# EAGLE design Line (EAGLE 9.6.2)
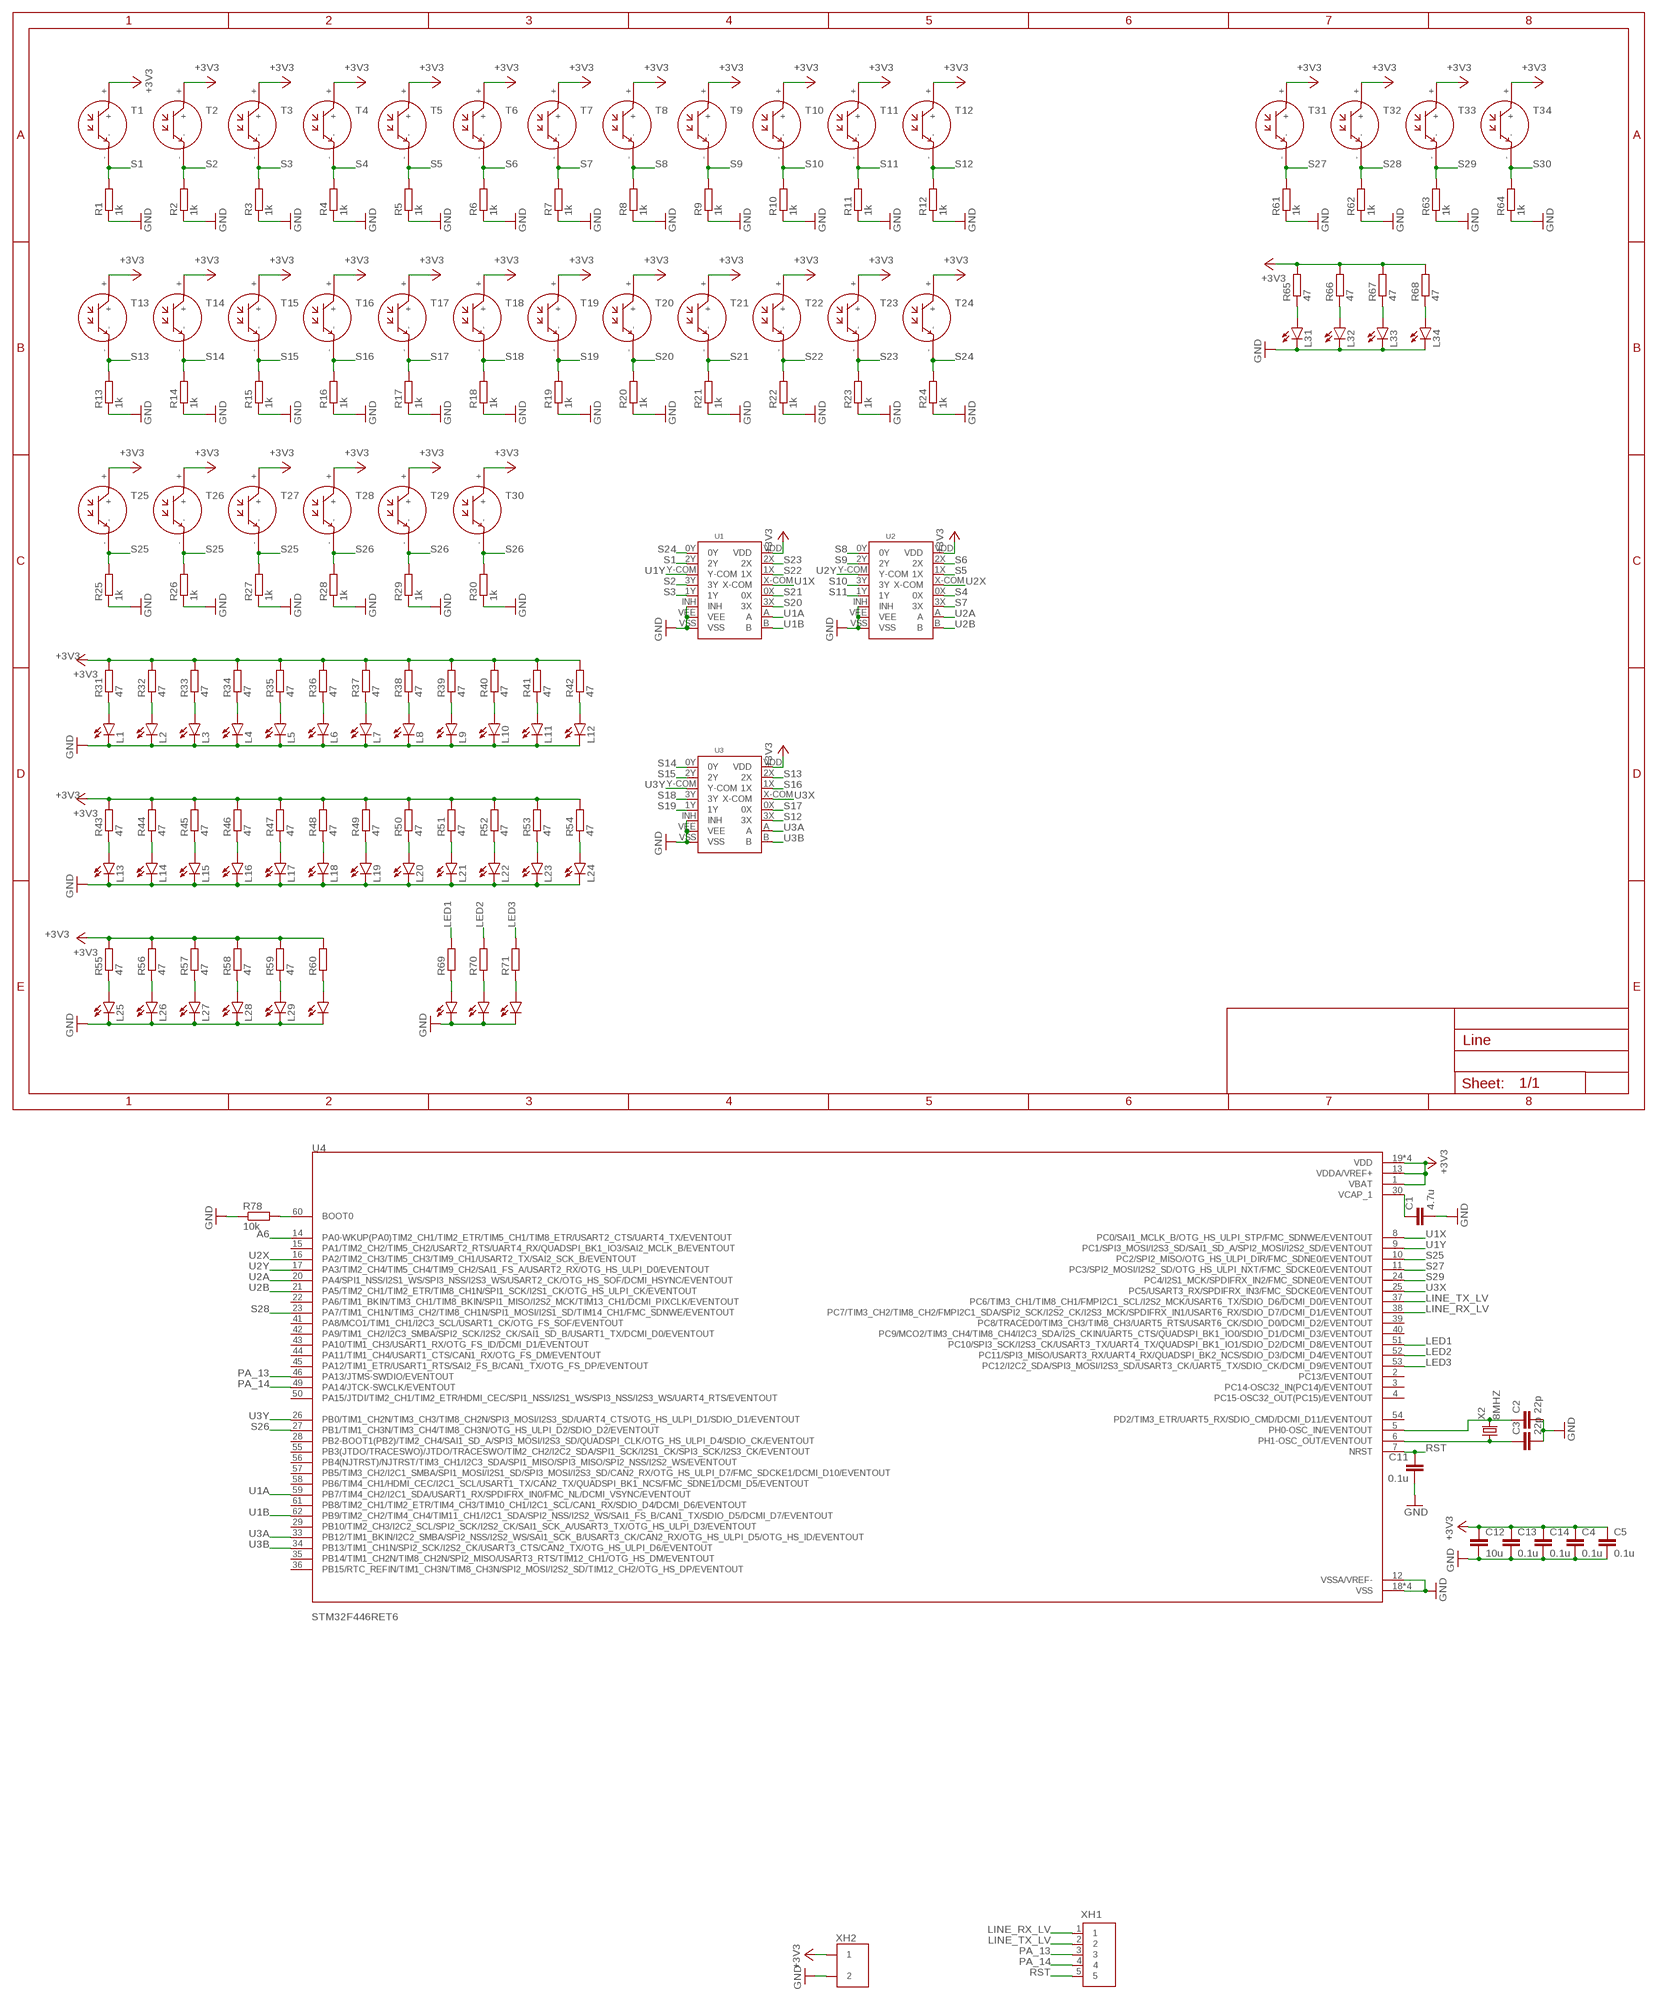
[diagram p0: schematic, sheet 1]

## Parts
C1  4.7u  C-EUC0603  [C0603]
C2  22p  C-EUC0603  [C0603]
C3  22p  C-EUC0603  [C0603]
C4  0.1u  C-EUC0603  [C0603]
C5  0.1u  C-EUC0603  [C0603]
C11  0.1u  C-EUC0603  [C0603]
C12  10u  C-EUC0805  [C0805]
C13  0.1u  C-EUC0603  [C0603]
C14  0.1u  C-EUC0603  [C0603]
L1  SML-E12P8WT86  [LED_SML-LXFM0603SIC-TR]
L2  SML-E12P8WT86  [LED_SML-LXFM0603SIC-TR]
L3  SML-E12P8WT86  [LED_SML-LXFM0603SIC-TR]
L4  SML-E12P8WT86  [LED_SML-LXFM0603SIC-TR]
L5  SML-E12P8WT86  [LED_SML-LXFM0603SIC-TR]
L6  SML-E12P8WT86  [LED_SML-LXFM0603SIC-TR]
L7  SML-E12P8WT86  [LED_SML-LXFM0603SIC-TR]
L8  SML-E12P8WT86  [LED_SML-LXFM0603SIC-TR]
L9  SML-E12P8WT86  [LED_SML-LXFM0603SIC-TR]
L10  SML-E12P8WT86  [LED_SML-LXFM0603SIC-TR]
L11  SML-E12P8WT86  [LED_SML-LXFM0603SIC-TR]
L12  SML-E12P8WT86  [LED_SML-LXFM0603SIC-TR]
L13  SML-E12P8WT86  [LED_SML-LXFM0603SIC-TR]
L14  SML-E12P8WT86  [LED_SML-LXFM0603SIC-TR]
L15  SML-E12P8WT86  [LED_SML-LXFM0603SIC-TR]
L16  SML-E12P8WT86  [LED_SML-LXFM0603SIC-TR]
L17  SML-E12P8WT86  [LED_SML-LXFM0603SIC-TR]
L18  SML-E12P8WT86  [LED_SML-LXFM0603SIC-TR]
L19  SML-E12P8WT86  [LED_SML-LXFM0603SIC-TR]
L20  SML-E12P8WT86  [LED_SML-LXFM0603SIC-TR]
L21  SML-E12P8WT86  [LED_SML-LXFM0603SIC-TR]
L22  SML-E12P8WT86  [LED_SML-LXFM0603SIC-TR]
L23  SML-E12P8WT86  [LED_SML-LXFM0603SIC-TR]
L24  SML-E12P8WT86  [LED_SML-LXFM0603SIC-TR]
L25  SML-E12P8WT86  [LED_SML-LXFM0603SIC-TR]
L26  SML-E12P8WT86  [LED_SML-LXFM0603SIC-TR]
L27  SML-E12P8WT86  [LED_SML-LXFM0603SIC-TR]
L28  SML-E12P8WT86  [LED_SML-LXFM0603SIC-TR]
L29  SML-E12P8WT86  [LED_SML-LXFM0603SIC-TR]
L30  SML-E12P8WT86  [LED_SML-LXFM0603SIC-TR]
L31  SML-E12P8WT86  [LED_SML-LXFM0603SIC-TR]
L32  SML-E12P8WT86  [LED_SML-LXFM0603SIC-TR]
L33  SML-E12P8WT86  [LED_SML-LXFM0603SIC-TR]
L34  SML-E12P8WT86  [LED_SML-LXFM0603SIC-TR]
L35  SML-E12P8WT86  [LED_SML-LXFM0603SIC-TR]
L36  SML-E12P8WT86  [LED_SML-LXFM0603SIC-TR]
L37  SML-E12P8WT86  [LED_SML-LXFM0603SIC-TR]
R1  1k  R-EU_R0603  [R0603]
R2  1k  R-EU_R0603  [R0603]
R3  1k  R-EU_R0603  [R0603]
R4  1k  R-EU_R0603  [R0603]
R5  1k  R-EU_R0603  [R0603]
R6  1k  R-EU_R0603  [R0603]
R7  1k  R-EU_R0603  [R0603]
R8  1k  R-EU_R0603  [R0603]
R9  1k  R-EU_R0603  [R0603]
R10  1k  R-EU_R0603  [R0603]
R11  1k  R-EU_R0603  [R0603]
R12  1k  R-EU_R0603  [R0603]
R13  1k  R-EU_R0603  [R0603]
R14  1k  R-EU_R0603  [R0603]
R15  1k  R-EU_R0603  [R0603]
R16  1k  R-EU_R0603  [R0603]
R17  1k  R-EU_R0603  [R0603]
R18  1k  R-EU_R0603  [R0603]
R19  1k  R-EU_R0603  [R0603]
R20  1k  R-EU_R0603  [R0603]
R21  1k  R-EU_R0603  [R0603]
R22  1k  R-EU_R0603  [R0603]
R23  1k  R-EU_R0603  [R0603]
R24  1k  R-EU_R0603  [R0603]
R25  1k  R-EU_R0603  [R0603]
R26  1k  R-EU_R0603  [R0603]
R27  1k  R-EU_R0603  [R0603]
R28  1k  R-EU_R0603  [R0603]
R29  1k  R-EU_R0603  [R0603]
R30  1k  R-EU_R0603  [R0603]
R31  47  R-EU_R0603  [R0603]
R32  47  R-EU_R0603  [R0603]
R33  47  R-EU_R0603  [R0603]
R34  47  R-EU_R0603  [R0603]
R35  47  R-EU_R0603  [R0603]
R36  47  R-EU_R0603  [R0603]
R37  47  R-EU_R0603  [R0603]
R38  47  R-EU_R0603  [R0603]
R39  47  R-EU_R0603  [R0603]
R40  47  R-EU_R0603  [R0603]
R41  47  R-EU_R0603  [R0603]
R42  47  R-EU_R0603  [R0603]
R43  47  R-EU_R0603  [R0603]
R44  47  R-EU_R0603  [R0603]
R45  47  R-EU_R0603  [R0603]
R46  47  R-EU_R0603  [R0603]
R47  47  R-EU_R0603  [R0603]
R48  47  R-EU_R0603  [R0603]
R49  47  R-EU_R0603  [R0603]
R50  47  R-EU_R0603  [R0603]
R51  47  R-EU_R0603  [R0603]
R52  47  R-EU_R0603  [R0603]
R53  47  R-EU_R0603  [R0603]
R54  47  R-EU_R0603  [R0603]
R55  47  R-EU_R0603  [R0603]
R56  47  R-EU_R0603  [R0603]
R57  47  R-EU_R0603  [R0603]
R58  47  R-EU_R0603  [R0603]
R59  47  R-EU_R0603  [R0603]
R60  47  R-EU_R0603  [R0603]
R61  1k  R-EU_R0603  [R0603]
R62  1k  R-EU_R0603  [R0603]
R63  1k  R-EU_R0603  [R0603]
R64  1k  R-EU_R0603  [R0603]
R65  47  R-EU_R0603  [R0603]
R66  47  R-EU_R0603  [R0603]
R67  47  R-EU_R0603  [R0603]
R68  47  R-EU_R0603  [R0603]
R69  150  R-EU_R0603  [R0603]
R70  150  R-EU_R0603  [R0603]
R71  150  R-EU_R0603  [R0603]
R78  10k  R-EU_R0603  [R0603]
T1  NJL7302L-F3  [NJL7302L-F3]
T2  NJL7302L-F3  [NJL7302L-F3]
T3  NJL7302L-F3  [NJL7302L-F3]
T4  NJL7302L-F3  [NJL7302L-F3]
T5  NJL7302L-F3  [NJL7302L-F3]
T6  NJL7302L-F3  [NJL7302L-F3]
T7  NJL7302L-F3  [NJL7302L-F3]
T8  NJL7302L-F3  [NJL7302L-F3]
T9  NJL7302L-F3  [NJL7302L-F3]
T10  NJL7302L-F3  [NJL7302L-F3]
T11  NJL7302L-F3  [NJL7302L-F3]
T12  NJL7302L-F3  [NJL7302L-F3]
T13  NJL7302L-F3  [NJL7302L-F3]
T14  NJL7302L-F3  [NJL7302L-F3]
T15  NJL7302L-F3  [NJL7302L-F3]
T16  NJL7302L-F3  [NJL7302L-F3]
T17  NJL7302L-F3  [NJL7302L-F3]
T18  NJL7302L-F3  [NJL7302L-F3]
T19  NJL7302L-F3  [NJL7302L-F3]
T20  NJL7302L-F3  [NJL7302L-F3]
T21  NJL7302L-F3  [NJL7302L-F3]
T22  NJL7302L-F3  [NJL7302L-F3]
T23  NJL7302L-F3  [NJL7302L-F3]
T24  NJL7302L-F3  [NJL7302L-F3]
T25  NJL7302L-F3  [NJL7302L-F3]
T26  NJL7302L-F3  [NJL7302L-F3]
T27  NJL7302L-F3  [NJL7302L-F3]
T28  NJL7302L-F3  [NJL7302L-F3]
T29  NJL7302L-F3  [NJL7302L-F3]
T30  NJL7302L-F3  [NJL7302L-F3]
T31  NJL7302L-F3  [NJL7302L-F3]
T32  NJL7302L-F3  [NJL7302L-F3]
T33  NJL7302L-F3  [NJL7302L-F3]
T34  NJL7302L-F3  [NJL7302L-F3]
U1  TC4051BP  [TC4051BP]
U2  TC4051BP  [TC4051BP]
U3  TC4051BP  [TC4051BP]
U4  STM32F446RET6  [QFP50P1200X1200X160-64N]
X2  8MHZ  16MHZ  [16MHZ]
XH1  5B  [5B]
XH2  2B  [2B]

## Nets
+3V3: C4.1 C5.1 C12.1 C13.1 C14.1 R31.2 R32.2 R33.2 R34.2 R35.2 R36.2 R37.2 R38.2 R39.2 R40.2 R41.2 R42.2 R43.2 R44.2 R45.2 R46.2 R47.2 R48.2 R49.2 R50.2 R51.2 R52.2 R53.2 R54.2 R55.2 R56.2 R57.2 R58.2 R59.2 R60.2 R65.2 R66.2 R67.2 R68.2 T1.+ T2.+ T3.+ T4.+ T5.+ T6.+ T7.+ T8.+ T9.+ T10.+ T11.+ T12.+ T13.+ T14.+ T15.+ T16.+ T17.+ T18.+ T19.+ T20.+ T21.+ T22.+ T23.+ T24.+ T25.+ T26.+ T27.+ T28.+ T29.+ T30.+ T31.+ T32.+ T33.+ T34.+ U1.VDD U2.VDD U3.VDD U4.1(VBAT) U4.13(VDDA/VREF+) U4.19(VDD) U4.32(VDD) U4.48(VDD) U4.64(VDD) XH2.P$1
A6: U4.14(PA0-WKUP(PA0)TIM2_CH1/TIM2_ETR/TIM5_CH1/TIM8_ETR/USART2_CTS/UART4_TX/EVENTOUT)
GND: C1.2 C2.2 C3.2 C4.2 C5.2 C11.2 C12.2 C13.2 C14.2 L1.C L2.C L3.C L4.C L5.C L6.C L7.C L8.C L9.C L10.C L11.C L12.C L13.C L14.C L15.C L16.C L17.C L18.C L19.C L20.C L21.C L22.C L23.C L24.C L25.C L26.C L27.C L28.C L29.C L30.C L31.C L32.C L33.C L34.C L35.C L36.C L37.C R1.1 R2.1 R3.1 R4.1 R5.1 R6.1 R7.1 R8.1 R9.1 R10.1 R11.1 R12.1 R13.1 R14.1 R15.1 R16.1 R17.1 R18.1 R19.1 R20.1 R21.1 R22.1 R23.1 R24.1 R25.1 R26.1 R27.1 R28.1 R29.1 R30.1 R61.1 R62.1 R63.1 R64.1 R78.1 U1.INH U1.VEE U1.VSS U2.INH U2.VEE U2.VSS U3.INH U3.VEE U3.VSS U4.12(VSSA/VREF-) U4.18(VSS) U4.31(VSS) U4.47(VSS) U4.63(VSS) XH2.P$2
LED1: R69.2 U4.51(PC10/SPI3_SCK/I2S3_CK/USART3_TX/UART4_TX/QUADSPI_BK1_IO1/SDIO_D2/DCMI_D8/EVENTOUT)
LED2: R70.2 U4.52(PC11/SPI3_MISO/USART3_RX/UART4_RX/QUADSPI_BK2_NCS/SDIO_D3/DCMI_D4/EVENTOUT)
LED3: R71.2 U4.53(PC12/I2C2_SDA/SPI3_MOSI/I2S3_SD/USART3_CK/UART5_TX/SDIO_CK/DCMI_D9/EVENTOUT)
LINE_RX_LV: U4.38(PC7/TIM3_CH2/TIM8_CH2/FMPI2C1_SDA/SPI2_SCK/I2S2_CK/I2S3_MCK/SPDIFRX_IN1/USART6_RX/SDIO_D7/DCMI_D1/EVENTOUT) XH1.1
LINE_TX_LV: U4.37(PC6/TIM3_CH1/TIM8_CH1/FMPI2C1_SCL/I2S2_MCK/USART6_TX/SDIO_D6/DCMI_D0/EVENTOUT) XH1.2
N$1: L1.A R31.1
N$2: L2.A R32.1
N$3: L3.A R33.1
N$4: L4.A R34.1
N$5: L5.A R35.1
N$6: L6.A R36.1
N$7: L7.A R37.1
N$8: L8.A R38.1
N$9: L9.A R39.1
N$10: L10.A R40.1
N$11: L11.A R41.1
N$12: L12.A R42.1
N$13: L13.A R43.1
N$14: L14.A R44.1
N$15: L15.A R45.1
N$16: L16.A R46.1
N$17: L17.A R47.1
N$18: L18.A R48.1
N$19: L19.A R49.1
N$20: L20.A R50.1
N$21: L21.A R51.1
N$22: L22.A R52.1
N$23: L23.A R53.1
N$24: L24.A R54.1
N$25: L25.A R55.1
N$26: L26.A R56.1
N$27: L27.A R57.1
N$28: L28.A R58.1
N$29: L29.A R59.1
N$30: L30.A R60.1
N$31: L31.A R65.1
N$32: L32.A R66.1
N$33: L33.A R67.1
N$34: L34.A R68.1
N$35: L35.A R69.1
N$36: L36.A R70.1
N$37: L37.A R71.1
N$42: C1.1 U4.30(VCAP_1)
N$43: R78.2 U4.60(BOOT0)
N$44: C2.1 U4.5(PH0-OSC_IN/EVENTOUT) X2.P$2
N$45: C3.1 U4.6(PH1-OSC_OUT/EVENTOUT) X2.P$1
PA_13: U4.46(PA13/JTMS-SWDIO/EVENTOUT) XH1.3
PA_14: U4.49(PA14/JTCK-SWCLK/EVENTOUT) XH1.4
RST: C11.1 U4.7(NRST) XH1.5
S1: R1.2 T1.- U1.2Y
S2: R2.2 T2.- U1.3Y
S3: R3.2 T3.- U1.1Y
S4: R4.2 T4.- U2.0X
S5: R5.2 T5.- U2.1X
S6: R6.2 T6.- U2.2X
S7: R7.2 T7.- U2.3X
S8: R8.2 T8.- U2.0Y
S9: R9.2 T9.- U2.2Y
S10: R10.2 T10.- U2.3Y
S11: R11.2 T11.- U2.1Y
S12: R12.2 T12.- U3.3X
S13: R13.2 T13.- U3.2X
S14: R14.2 T14.- U3.0Y
S15: R15.2 T15.- U3.2Y
S16: R16.2 T16.- U3.1X
S17: R17.2 T17.- U3.0X
S18: R18.2 T18.- U3.3Y
S19: R19.2 T19.- U3.1Y
S20: R20.2 T20.- U1.3X
S21: R21.2 T21.- U1.0X
S22: R22.2 T22.- U1.1X
S23: R23.2 T23.- U1.2X
S24: R24.2 T24.- U1.0Y
S25: R25.2 R26.2 R27.2 T25.- T26.- T27.- U4.10(PC2/SPI2_MISO/OTG_HS_ULPI_DIR/FMC_SDNE0/EVENTOUT)
S26: R28.2 R29.2 R30.2 T28.- T29.- T30.- U4.27(PB1/TIM1_CH3N/TIM3_CH4/TIM8_CH3N/OTG_HS_ULPI_D2/SDIO_D2/EVENTOUT)
S27: R61.2 T31.- U4.11(PC3/SPI2_MOSI/I2S2_SD/OTG_HS_ULPI_NXT/FMC_SDCKE0/EVENTOUT)
S28: R62.2 T32.- U4.23(PA7/TIM1_CH1N/TIM3_CH2/TIM8_CH1N/SPI1_MOSI/I2S1_SD/TIM14_CH1/FMC_SDNWE/EVENTOUT)
S29: R63.2 T33.- U4.24(PC4/I2S1_MCK/SPDIFRX_IN2/FMC_SDNE0/EVENTOUT)
S30: R64.2 T34.-
U1A: U1.A U4.59(PB7/TIM4_CH2/I2C1_SDA/USART1_RX/SPDIFRX_IN0/FMC_NL/DCMI_VSYNC/EVENTOUT)
U1B: U1.B U4.62(PB9/TIM2_CH2/TIM4_CH4/TIM11_CH1/I2C1_SDA/SPI2_NSS/I2S2_WS/SAI1_FS_B/CAN1_TX/SDIO_D5/DCMI_D7/EVENTOUT)
U1X: U1.X-COM U4.8(PC0/SAI1_MCLK_B/OTG_HS_ULPI_STP/FMC_SDNWE/EVENTOUT)
U1Y: U1.Y-COM U4.9(PC1/SPI3_MOSI/I2S3_SD/SAI1_SD_A/SPI2_MOSI/I2S2_SD/EVENTOUT)
U2A: U2.A U4.20(PA4/SPI1_NSS/I2S1_WS/SPI3_NSS/I2S3_WS/USART2_CK/OTG_HS_SOF/DCMI_HSYNC/EVENTOUT)
U2B: U2.B U4.21(PA5/TIM2_CH1/TIM2_ETR/TIM8_CH1N/SPI1_SCK/I2S1_CK/OTG_HS_ULPI_CK/EVENTOUT)
U2X: U2.X-COM U4.16(PA2/TIM2_CH3/TIM5_CH3/TIM9_CH1/USART2_TX/SAI2_SCK_B/EVENTOUT)
U2Y: U2.Y-COM U4.17(PA3/TIM2_CH4/TIM5_CH4/TIM9_CH2/SAI1_FS_A/USART2_RX/OTG_HS_ULPI_D0/EVENTOUT)
U3A: U3.A U4.33(PB12/TIM1_BKIN/I2C2_SMBA/SPI2_NSS/I2S2_WS/SAI1_SCK_B/USART3_CK/CAN2_RX/OTG_HS_ULPI_D5/OTG_HS_ID/EVENTOUT)
U3B: U3.B U4.34(PB13/TIM1_CH1N/SPI2_SCK/I2S2_CK/USART3_CTS/CAN2_TX/OTG_HS_ULPI_D6/EVENTOUT)
U3X: U3.X-COM U4.25(PC5/USART3_RX/SPDIFRX_IN3/FMC_SDCKE0/EVENTOUT)
U3Y: U3.Y-COM U4.26(PB0/TIM1_CH2N/TIM3_CH3/TIM8_CH2N/SPI3_MOSI/I2S3_SD/UART4_CTS/OTG_HS_ULPI_D1/SDIO_D1/EVENTOUT)
Unconnected: U4.2(PC13/EVENTOUT) U4.3(PC14-OSC32_IN(PC14)/EVENTOUT) U4.4(PC15-OSC32_OUT(PC15)/EVENTOUT) U4.15(PA1/TIM2_CH2/TIM5_CH2/USART2_RTS/UART4_RX/QUADSPI_BK1_IO3/SAI2_MCLK_B/EVENTOUT) U4.22(PA6/TIM1_BKIN/TIM3_CH1/TIM8_BKIN/SPI1_MISO/I2S2_MCK/TIM13_CH1/DCMI_PIXCLK/EVENTOUT) U4.28(PB2-BOOT1(PB2)/TIM2_CH4/SAI1_SD_A/SPI3_MOSI/I2S3_SD/QUADSPI_CLK/OTG_HS_ULPI_D4/SDIO_CK/EVENTOUT) U4.29(PB10/TIM2_CH3/I2C2_SCL/SPI2_SCK/I2S2_CK/SAI1_SCK_A/USART3_TX/OTG_HS_ULPI_D3/EVENTOUT) U4.35(PB14/TIM1_CH2N/TIM8_CH2N/SPI2_MISO/USART3_RTS/TIM12_CH1/OTG_HS_DM/EVENTOUT) U4.36(PB15/RTC_REFIN/TIM1_CH3N/TIM8_CH3N/SPI2_MOSI/I2S2_SD/TIM12_CH2/OTG_HS_DP/EVENTOUT) U4.39(PC8/TRACED0/TIM3_CH3/TIM8_CH3/UART5_RTS/USART6_CK/SDIO_D0/DCMI_D2/EVENTOUT) U4.40(PC9/MCO2/TIM3_CH4/TIM8_CH4/I2C3_SDA/I2S_CKIN/UART5_CTS/QUADSPI_BK1_IO0/SDIO_D1/DCMI_D3/EVENTOUT) U4.41(PA8/MCO1/TIM1_CH1/I2C3_SCL/USART1_CK/OTG_FS_SOF/EVENTOUT) U4.42(PA9/TIM1_CH2/I2C3_SMBA/SPI2_SCK/I2S2_CK/SAI1_SD_B/USART1_TX/DCMI_D0/EVENTOUT) U4.43(PA10/TIM1_CH3/USART1_RX/OTG_FS_ID/DCMI_D1/EVENTOUT) U4.44(PA11/TIM1_CH4/USART1_CTS/CAN1_RX/OTG_FS_DM/EVENTOUT) U4.45(PA12/TIM1_ETR/USART1_RTS/SAI2_FS_B/CAN1_TX/OTG_FS_DP/EVENTOUT) U4.50(PA15/JTDI/TIM2_CH1/TIM2_ETR/HDMI_CEC/SPI1_NSS/I2S1_WS/SPI3_NSS/I2S3_WS/UART4_RTS/EVENTOUT) U4.54(PD2/TIM3_ETR/UART5_RX/SDIO_CMD/DCMI_D11/EVENTOUT) U4.55(PB3(JTDO/TRACESWO)/JTDO/TRACESWO/TIM2_CH2/I2C2_SDA/SPI1_SCK/I2S1_CK/SPI3_SCK/I2S3_CK/EVENTOUT) U4.56(PB4(NJTRST)/NJTRST/TIM3_CH1/I2C3_SDA/SPI1_MISO/SPI3_MISO/SPI2_NSS/I2S2_WS/EVENTOUT) U4.57(PB5/TIM3_CH2/I2C1_SMBA/SPI1_MOSI/I2S1_SD/SPI3_MOSI/I2S3_SD/CAN2_RX/OTG_HS_ULPI_D7/FMC_SDCKE1/DCMI_D10/EVENTOUT) U4.58(PB6/TIM4_CH1/HDMI_CEC/I2C1_SCL/USART1_TX/CAN2_TX/QUADSPI_BK1_NCS/FMC_SDNE1/DCMI_D5/EVENTOUT) U4.61(PB8/TIM2_CH1/TIM2_ETR/TIM4_CH3/TIM10_CH1/I2C1_SCL/CAN1_RX/SDIO_D4/DCMI_D6/EVENTOUT)

## Library data of the parts
C1-C5 C11-C14 = rcl:C-EU: CAPACITOR, European symbol; SPICEPREFIX: C
L1-L37 = LED:SML-E12P8WT86
R1-R71 R78 = rcl:R-EU_: RESISTOR, European symbol; SPICEPREFIX: R
T1-T34 = NJL7302L-F3:NJL7302L-F3
U1-U3 = TC4051BP:TC4051BP
U4 = STM32F446RET6:STM32F446RET6: MCU 32-Bit STM32 ARM Cortex M4 RISC 512KB Flash 2.5V/3.3V 64-Pin LQFP Tray Check availability <https://pricing.snapeda.com/parts/STM32F446RET6/STMicroelectronics/view-part?ref=eda>; AVAILABILITY: In Stock; DESCRIPTION: ARM® Cortex®-M4 STM32F4 Microcontroller IC 32-Bit Single-Core 180MHz 512KB (512K x 8) FLASH 64-LQFP (10x10); MF: STMicroelectronics; MP: STM32F446RET6; PACKAGE: LQFP-64 STMicroelectronics; PRICE: None; PURCHASE-URL: https://pricing.snapeda.com/search/part/STM32F446RET6/?ref=eda
X2 = crystal:16MHZ
XH1 = XH:5B
XH2 = XH:2B

## Board
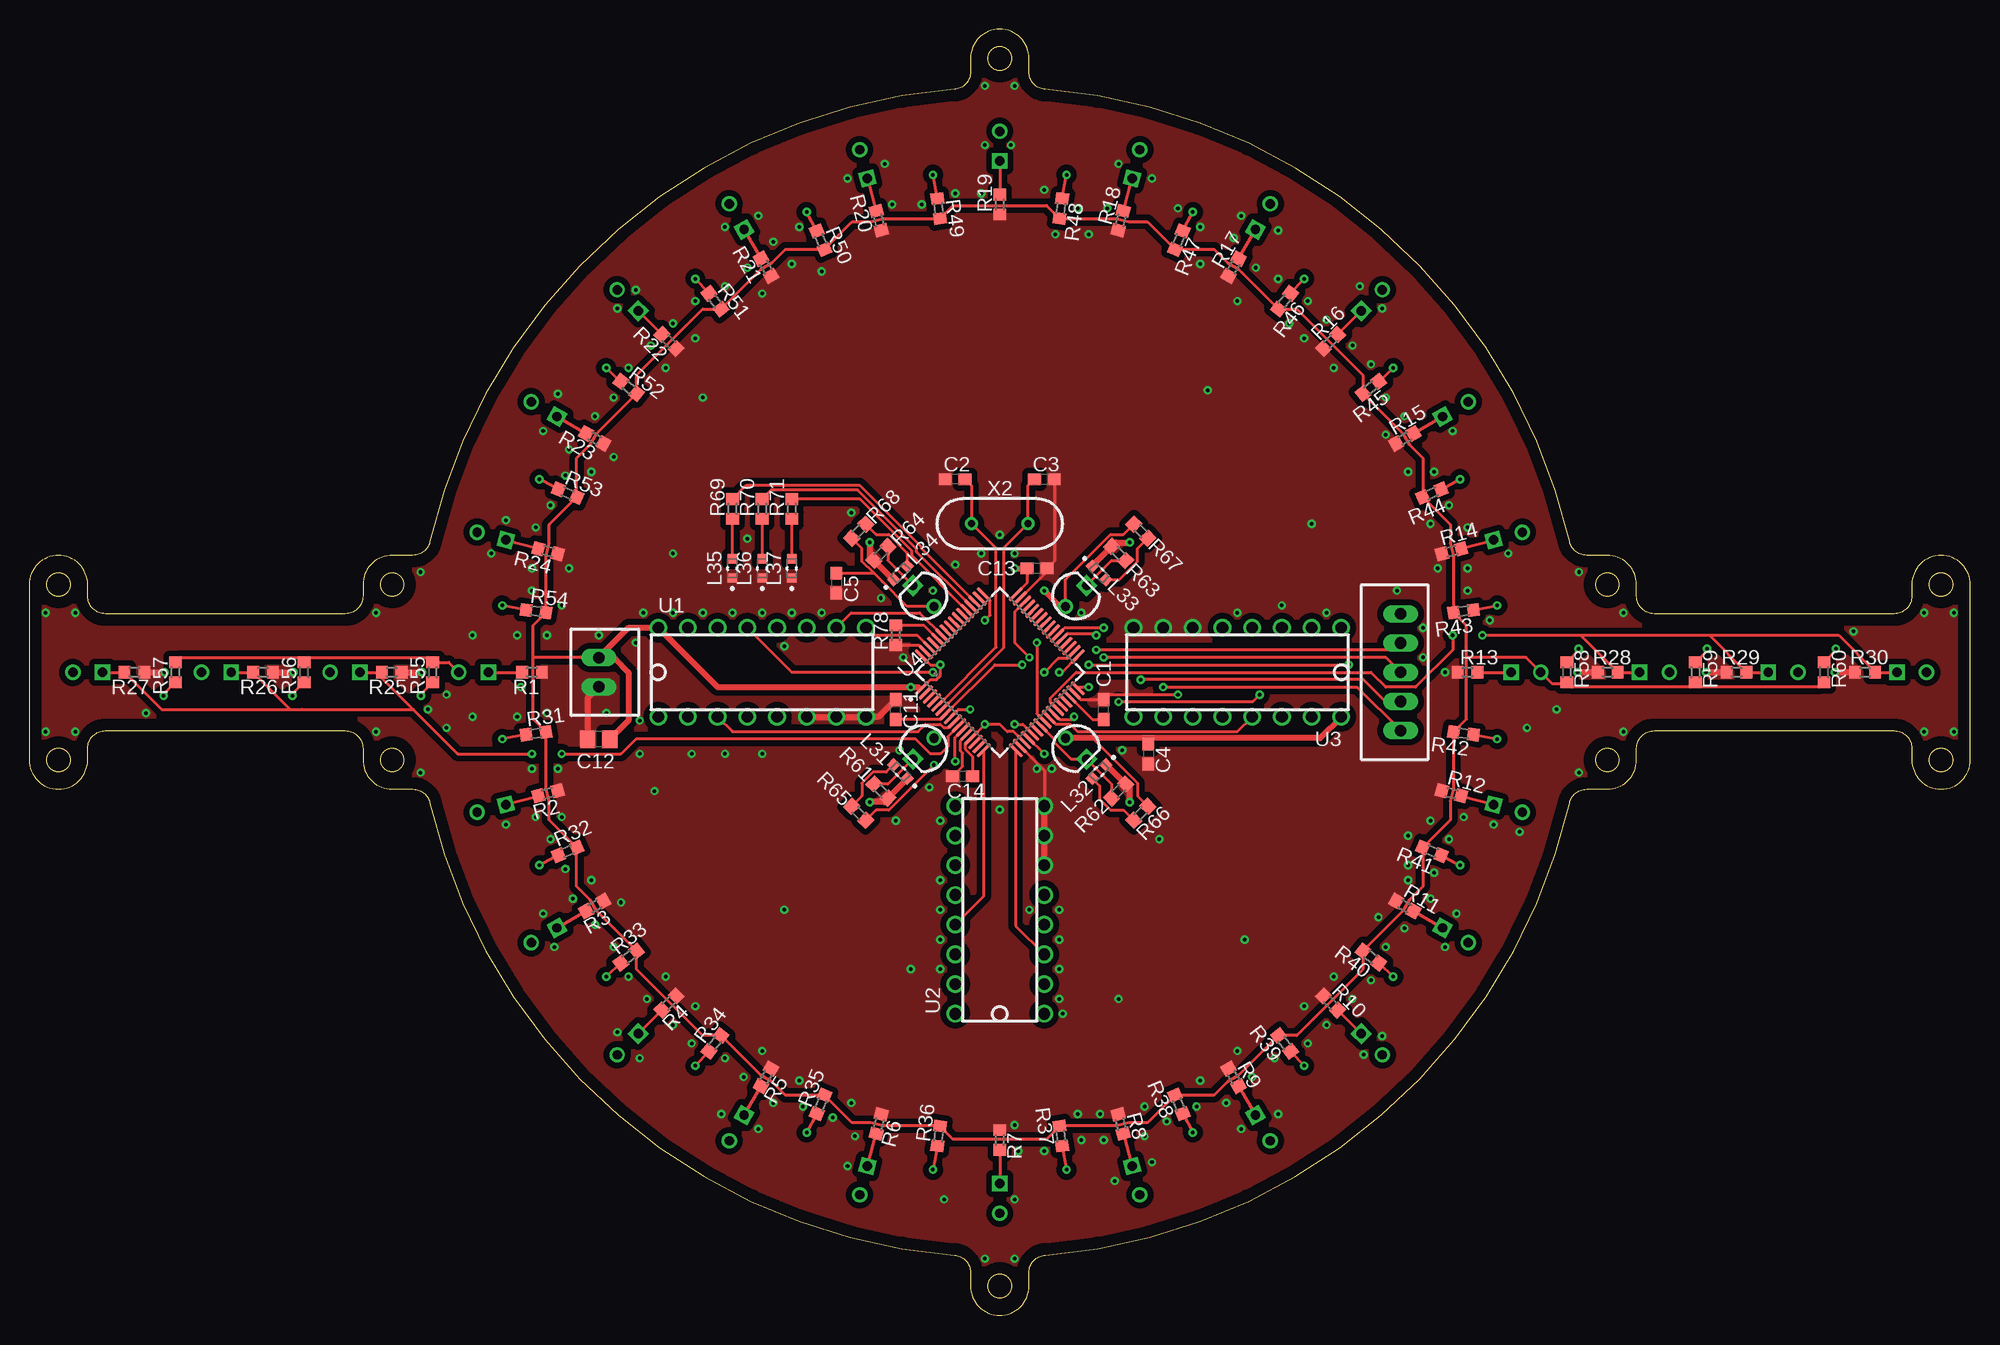
[diagram p1: board, top side]
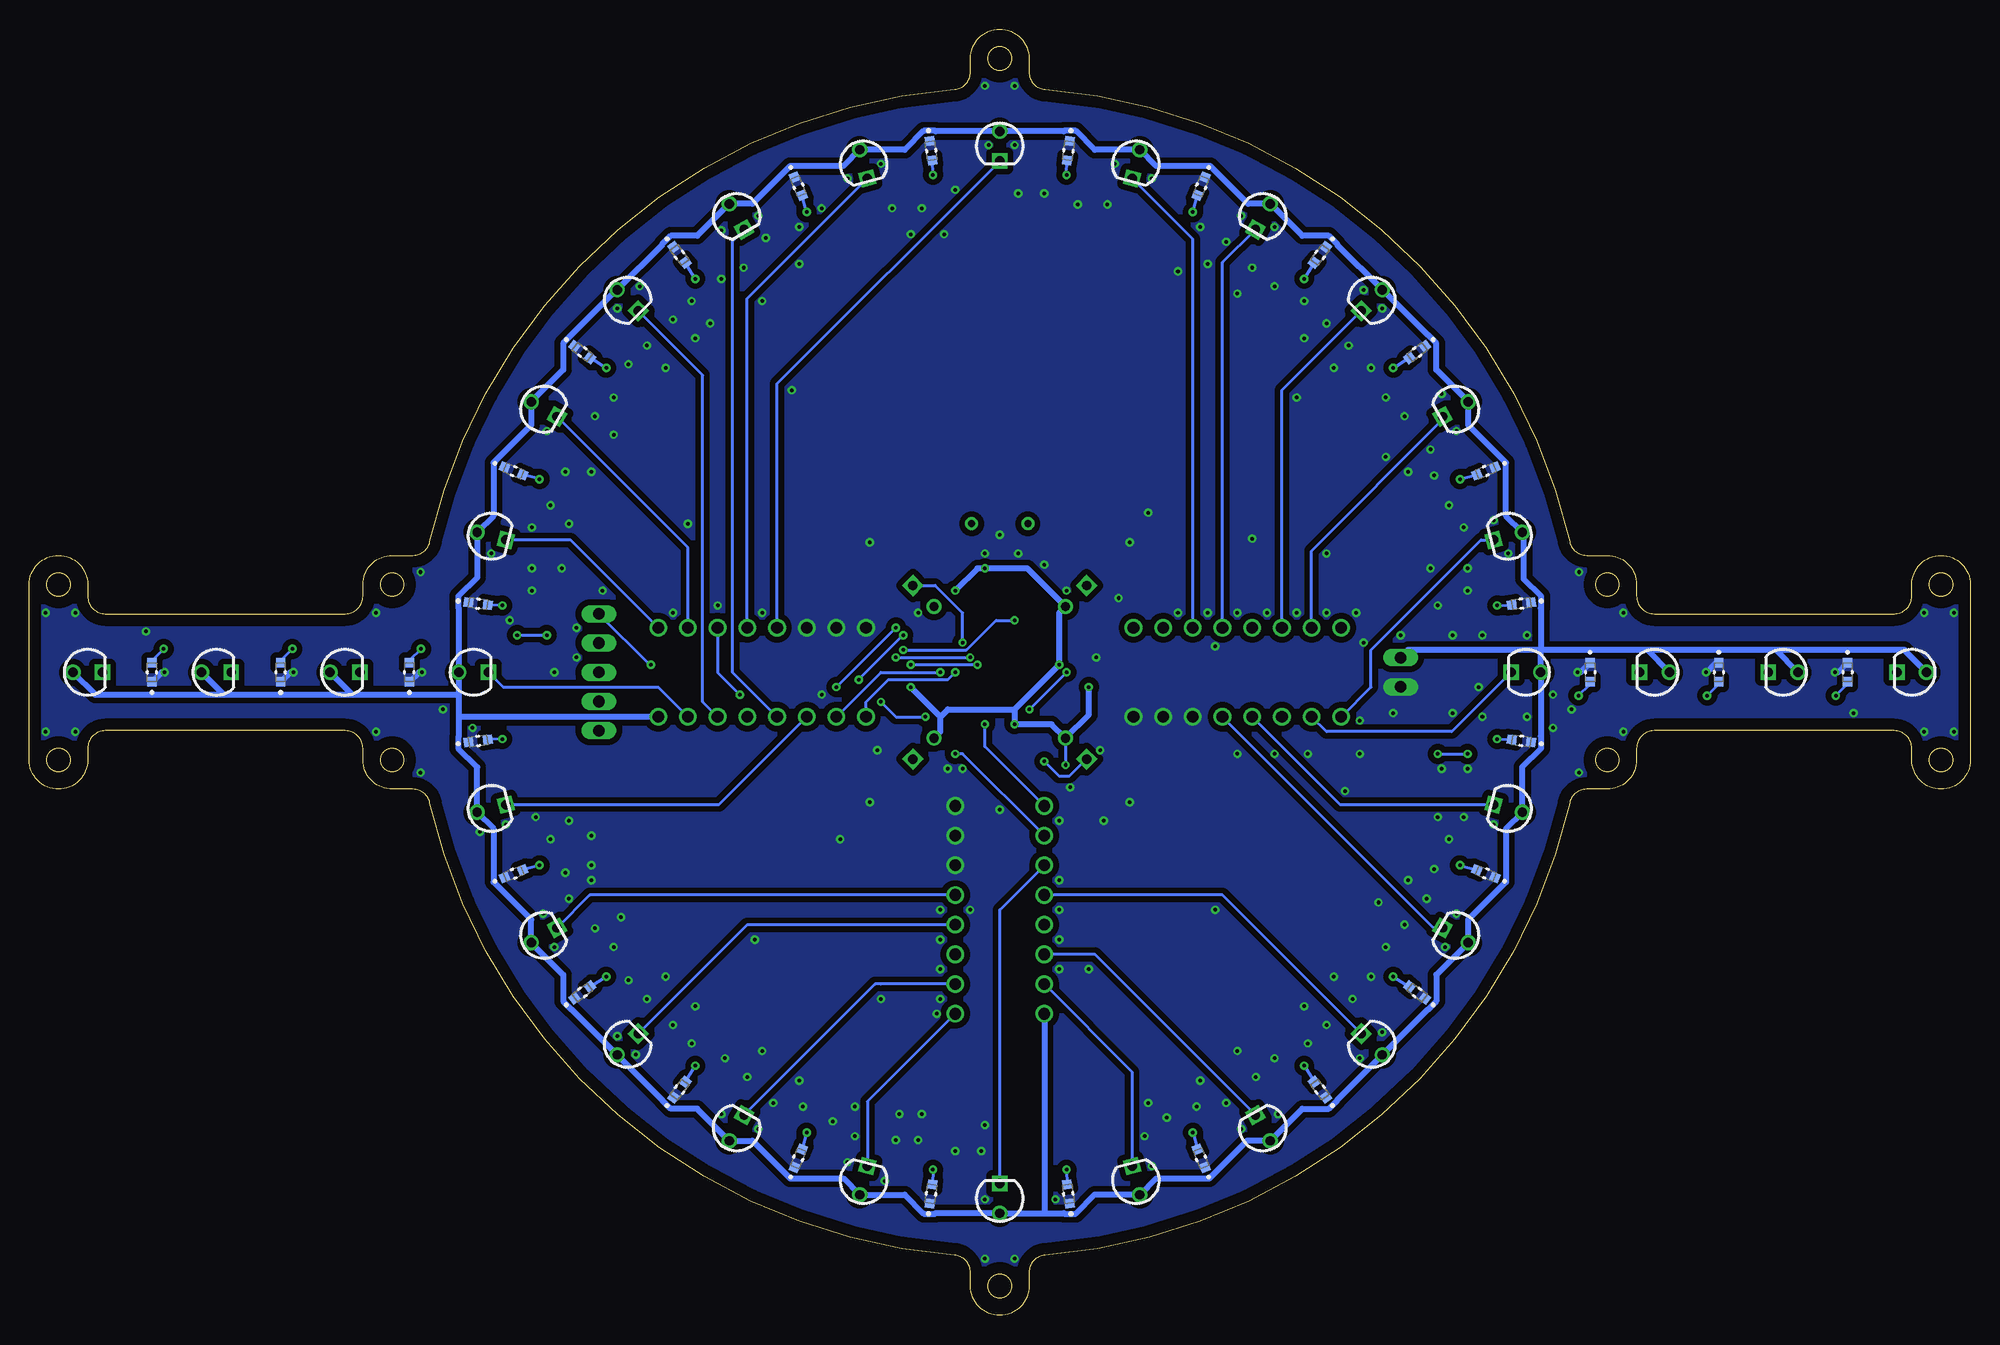
[diagram p2: board, bottom side, seen from below]

Size 166 x 110 mm. Coordinates in mm from the lower left corner, seen from the top.
Outline: 0,62.5 0,47.5 arc180 5,47.5 5,48.5 arc-90 6.5,50 27.04,50 arc-90 28.54,48.5 28.54,47.5 arc90 31.04,45 32.8,45 arc-77 34.26,43.84 arc73 79.12,5.15 arc-86 80.5,3.66 80.5,2.5 arc180 85.5,2.5 85.5,3.66 arc-86 86.88,5.15 arc73 131.74,43.84 arc-77 133.2,45 134.96,45 arc90 137.46,47.5 137.46,48.5 arc-90 138.96,50 159.5,50 arc-90 161,48.5 161,47.5 arc180 166,47.5 166,62.5 arc180 161,62.5 161,61.5 arc-90 159.5,60 138.96,60 arc-90 137.46,61.5 137.46,62.5 arc90 134.96,65 133.2,65 arc-77 131.74,66.16 arc73 86.88,104.85 arc-86 85.5,106.34 85.5,107.5 arc180 80.5,107.5 80.5,106.34 arc-86 79.12,104.85 arc73 34.26,66.16 arc-77 32.8,65 31.04,65 arc90 28.54,62.5 28.54,61.5 arc-90 27.04,60 6.5,60 arc-90 5,61.5 5,62.5 arc180 0,62.5
Outline: circle at 31.04,62.5 radius 1
Outline: circle at 134.96,47.5 radius 1
Outline: circle at 31.04,47.5 radius 1
Outline: circle at 134.96,62.5 radius 1
Outline: circle at 83,107.5 radius 1
Outline: circle at 83,2.5 radius 1
Outline: circle at 2.5,47.5 radius 1
Outline: circle at 2.5,62.5 radius 1
Outline: circle at 163.5,62.5 radius 1
Outline: circle at 163.5,47.5 radius 1
Copper layers (1*16): Top 0.035mm / dielectric 1.5mm / Bottom 0.035mm
Design rules "default *": minimum track width 6mil, minimum drill 0.3mm, track to track 6mil, track to pad 6mil, pad to pad 6mil, via to via 6mil, smd to smd 6mil, copper to edge 40mil, drill to drill 6mil, minimum pad ring 10mil, minimum via ring 8mil, stop-mask expansion 4mil, vias tented up to drill 0mil, thermal gap 10mil

### Footprints (pad centres in the part's own frame; a part is rotated, then mirrored left to right if it is on the bottom)
C0603 = smd 1.1 x 1: 1 -0.85,0; 2 0.85,0
C0805 = smd 1.3 x 1.5: 1 -0.95,0; 2 0.95,0
LED_SML-LXFM0603SIC-TR = smd 0.8 x 0.8: A 0.825,0; C -0.825,0
R0603 = smd 1 x 1.1: 1 -0.85,0; 2 0.85,0
NJL7302L-F3 = drill 0.8: + 1.27,0 | drill 0.8 square: - -1.27,0
TC4051BP = drill 1: 0X 1.27,3.81; 0Y -8.89,-3.81; 1X -3.81,3.81; 1Y 1.27,-3.81; 2X -6.35,3.81; 2Y -6.35,-3.81; 3X 3.81,3.81; 3Y -1.27,-3.81; A 6.35,3.81; B 8.89,3.81; INH 3.81,-3.81; VDD -8.89,3.81; VEE 6.35,-3.81; VSS 8.89,-3.81; X-COM -1.27,3.81; Y-COM -3.81,-3.81
QFP50P1200X1200X160-64N = smd 1.56 x 0.28: 1 -5.68,3.75; 2 -5.68,3.25; 3 -5.68,2.75; 4 -5.68,2.25; 5 -5.68,1.75; 6 -5.68,1.25; 7 -5.68,0.75; 8 -5.68,0.25; 9 -5.68,-0.25; 10 -5.68,-0.75; 11 -5.68,-1.25; 12 -5.68,-1.75; 13 -5.68,-2.25; 14 -5.68,-2.75; 15 -5.68,-3.25; 16 -5.68,-3.75; 33 5.68,-3.75; 34 5.68,-3.25; 35 5.68,-2.75; 36 5.68,-2.25; 37 5.68,-1.75; 38 5.68,-1.25; 39 5.68,-0.75; 40 5.68,-0.25; 41 5.68,0.25; 42 5.68,0.75; 43 5.68,1.25; 44 5.68,1.75; 45 5.68,2.25; 46 5.68,2.75; 47 5.68,3.25; 48 5.68,3.75 | smd 0.28 x 1.56: 17 -3.75,-5.68; 18 -3.25,-5.68; 19 -2.75,-5.68; 20 -2.25,-5.68; 21 -1.75,-5.68; 22 -1.25,-5.68; 23 -0.75,-5.68; 24 -0.25,-5.68; 25 0.25,-5.68; 26 0.75,-5.68; 27 1.25,-5.68; 28 1.75,-5.68; 29 2.25,-5.68; 30 2.75,-5.68; 31 3.25,-5.68; 32 3.75,-5.68; 49 3.75,5.68; 50 3.25,5.68; 51 2.75,5.68; 52 2.25,5.68; 53 1.75,5.68; 54 1.25,5.68; 55 0.75,5.68; 56 0.25,5.68; 57 -0.25,5.68; 58 -0.75,5.68; 59 -1.25,5.68; 60 -1.75,5.68; 61 -2.25,5.68; 62 -2.75,5.68; 63 -3.25,5.68; 64 -3.75,5.68
16MHZ = drill 0.6: P$1 -2.4,0; P$2 2.4,0
5B = drill 1 long: 1 0,5; 2 0,2.5; 3 0,0; 4 0,-2.5; 5 0,-5
2B = drill 1 long: P$1 0,1.25; P$2 0,-1.25

### Placement (x,y rotation side)
C1  91.89,51.83 90 top
C2  79.19,71.51 180 top
C3  86.81,71.51 0 top
C4  95.7,48.02 270 top
C5  69.03,62.62 270 top
C11  74.11,51.83 90 top
C12  48.71,49.28 180 top
C13  86.17,63.89 0 top
C14  79.83,46.11 180 top
L1  38.38,49.13 172.5 bottom
L2  41.43,37.78 157.5 bottom
L3  47.3,27.61 142.5 bottom
L4  55.61,19.3 127.5 bottom
L5  65.78,13.43 112.5 bottom
L6  77.13,10.38 97.5 bottom
L7  88.87,10.38 82.5 bottom
L8  100.22,13.43 67.5 bottom
L9  110.39,19.3 52.5 bottom
L10  118.7,27.61 37.5 bottom
L11  124.57,37.78 22.5 bottom
L12  127.62,49.13 7.5 bottom
L13  127.62,60.87 352.5 bottom
L14  124.57,72.22 337.5 bottom
L15  118.7,82.39 322.5 bottom
L16  110.39,90.7 307.5 bottom
L17  100.22,96.57 292.5 bottom
L18  88.87,99.62 277.5 bottom
L19  77.13,99.62 262.5 bottom
L20  65.78,96.57 247.5 bottom
L21  55.61,90.7 232.5 bottom
L22  47.3,82.39 217.5 bottom
L23  41.43,72.22 202.5 bottom
L24  38.38,60.87 187.5 bottom
L25  32.5,55 270 bottom
L26  21.5,55 270 bottom
L27  10.5,55 270 bottom
L28  133.5,55 90 bottom
L29  144.5,55 90 bottom
L30  155.5,55 90 bottom
L31  74.5,46.5 135 top
L32  91.5,46.5 225 top
L33  91.5,63.5 315 top
L34  74.5,63.5 45 top
L35  60.14,63.89 90 top
L36  62.68,63.89 90 top
L37  65.22,63.89 90 top
R1  43,55 180 top
R2  44.36,44.65 195 top
R3  48.36,35 210 top
R4  54.72,26.72 225 top
R5  63,20.36 240 top
R6  72.65,16.36 255 top
R7  83,15 270 top
R8  93.35,16.36 285 top
R9  103,20.36 300 top
R10  111.28,26.72 315 top
R11  117.64,35 330 top
R12  121.64,44.65 345 top
R13  123,55 0 top
R14  121.64,65.35 15 top
R15  117.64,75 30 top
R16  111.28,83.28 45 top
R17  103,89.64 60 top
R18  93.35,93.64 75 top
R19  83,95 90 top
R20  72.65,93.64 105 top
R21  63,89.64 120 top
R22  54.72,83.28 135 top
R23  48.36,75 150 top
R24  44.36,65.35 165 top
R25  31,55 180 top
R26  20,55 180 top
R27  9,55 180 top
R28  135,55 0 top
R29  146,55 0 top
R30  157,55 0 top
R31  43.34,49.78 7.5 top
R32  46.04,39.69 22.5 top
R33  51.27,30.65 37.5 top
R34  58.65,23.27 52.5 top
R35  67.69,18.04 67.5 top
R36  77.78,15.34 82.5 top
R37  88.22,15.34 97.5 top
R38  98.31,18.04 112.5 top
R39  107.35,23.27 127.5 top
R40  114.73,30.65 142.5 top
R41  119.96,39.69 157.5 top
R42  122.66,49.78 172.5 top
R43  122.66,60.22 187.5 top
R44  119.96,70.31 202.5 top
R45  114.73,79.35 217.5 top
R46  107.35,86.73 232.5 top
R47  98.31,91.96 247.5 top
R48  88.22,94.66 262.5 top
R49  77.78,94.66 277.5 top
R50  67.69,91.96 292.5 top
R51  58.65,86.73 307.5 top
R52  51.27,79.35 322.5 top
R53  46.04,70.31 337.5 top
R54  43.34,60.22 352.5 top
R55  34.5,55 90 top
R56  23.5,55 90 top
R57  12.5,55 90 top
R58  131.5,55 270 top
R59  142.5,55 270 top
R60  153.5,55 270 top
R61  72.84,44.84 135 top
R62  93.16,44.84 225 top
R63  93.16,65.16 315 top
R64  72.84,65.16 45 top
R65  70.94,42.94 315 top
R66  95.06,42.94 45 top
R67  95.06,67.06 135 top
R68  70.94,67.06 225 top
R69  60.14,68.97 90 top
R70  62.68,68.97 90 top
R71  65.22,68.97 90 top
R78  74.11,58.17 90 top
T1  38,55 0 bottom
T2  39.53,43.35 345 bottom
T3  44.03,32.5 330 bottom
T4  51.18,23.18 315 bottom
T5  60.5,16.03 300 bottom
T6  71.35,11.53 285 bottom
T7  83,10 270 bottom
T8  94.65,11.53 255 bottom
T9  105.5,16.03 240 bottom
T10  114.82,23.18 225 bottom
T11  121.97,32.5 210 bottom
T12  126.47,43.35 195 bottom
T13  128,55 180 bottom
T14  126.47,66.65 165 bottom
T15  121.97,77.5 150 bottom
T16  114.82,86.82 135 bottom
T17  105.5,93.97 120 bottom
T18  94.65,98.47 105 bottom
T19  83,100 90 bottom
T20  71.35,98.47 75 bottom
T21  60.5,93.97 60 bottom
T22  51.18,86.82 45 bottom
T23  44.03,77.5 30 bottom
T24  39.53,66.65 15 bottom
T25  27,55 0 bottom
T26  16,55 0 bottom
T27  5,55 0 bottom
T28  139,55 180 bottom
T29  150,55 180 bottom
T30  161,55 180 bottom
T31  76.47,48.47 45 top
T32  89.53,48.47 135 top
T33  89.53,61.53 225 top
T34  76.47,61.53 315 top
U1  62.68,55 0 top
U2  83,34.68 90 top
U3  103.32,55 180 top
U4  83,55 45 top
X2  83,67.7 180 top
XH1  117.29,55 180 top
XH2  48.71,55 0 top

### Tracks (layer width: path | path; a pad name or v marks a point on that pad's centre or on a via)
+3V3  (via drill 0.3)
  Top 0.25: R67.2 93.58,66.78 92.48,66.78 88.63,62.93 T33.+ | R68.2 71.22,65.58 71.22,64.48 72.23,63.47 | T34.+ 75.07,60.63 72.96,62.74 72.23,63.47 | R65.2 72.42,43.22 73.52,43.22 v77.37,47.07 | R66.2 94.78,44.42 94.78,45.52 90.93,49.37 T32.+ | 76.02,53.73 76.24,53.73 U4.1 77.06,54.37 77.6,54.37 77.92,54.68 v77.92,55.63 77.06,55.63 U4.64 | C14.1 80.67,47.8 80.03,48.44 80.03,48.85 U4.13 v81.73,50.55 83,50.55 83.64,49.92 84.19,49.92 U4.19 | C13.1 85.33,62.63 U4.48 | U4.32 89.76,53.73 v90.62,53.73 | 122.93,56.27 122.93,51 R42.2 121.81,45.03 121.53,43.99 121.53,42.38 R41.2 119.17,36.67 118.04,35.54 117.5,34.6 R40.2 114.06,29.59 108.41,23.94 R39.2 103.4,20.51 102.46,19.96 101.33,18.83 R38.2 95.62,16.47 94.01,16.47 92.97,16.19 R37.2 87,15.07 79,15.07 R36.2 73.03,16.19 71.99,16.47 70.38,16.47 R35.2 64.67,18.83 63.54,19.96 62.6,20.51 R34.2 57.59,23.94 51.94,29.59 R33.2 48.51,34.6 47.96,35.54 46.83,36.67 R32.2 44.47,42.38 44.47,43.99 44.19,45.03 R31.2 43.07,51 43.07,56.27 | 122.93,56.27 122.93,59 R43.2 121.81,64.97 121.53,66.01 121.53,67.62 R44.2 119.17,73.33 118.04,74.46 117.5,75.4 R45.2 114.06,80.41 108.41,86.06 R46.2 103.4,89.5 102.46,90.04 101.33,91.17 R47.2 95.62,93.53 94.01,93.53 92.97,93.81 R48.2 87,94.93 79,94.93 R49.2 73.03,93.81 71.99,93.53 70.38,93.53 R50.2 64.67,91.17 63.54,90.04 62.6,89.5 R51.2 57.59,86.06 51.94,80.41 R52.2 48.51,75.4 47.96,74.46 46.83,73.33 R53.2 44.47,67.62 44.47,66.01 44.19,64.97 R54.2 43.07,59 43.07,56.27 | R57.2 12.92,56.27 23.92,56.27 | 23.92,56.27 34.08,56.27 R55.2 35.88,55.85 T1.+ | R56.2 23.92,56.27
  Top 0.25: R60.2 153.08,53.73 142.08,53.73 | 131.59,54.06 131.92,53.73 142.08,53.73 | 131.59,54.06 R58.2 | R59.2 142.08,53.73 | 131.59,54.06 130.21,54.06 T13.+ 128,56.27 122.93,56.27 | XH2.P$1 48.69,56.27 43.07,56.27 | C5.1 72.23,63.47
  Top 0.5: 76.02,53.73 v75.38,53.73 58.87,53.73 U1.VDD 51.27,58.81 XH2.P$1 50,56.25 51.25,55 51.25,50.88 C12.1 | v84.27,63.89 C13.1 | v86.81,61.98 88.17,60.63 T33.+ | U3.VDD 110.39,49.37 95.7,49.37 | 95.7,49.37 T32.+ | C4.1 95.7,49.37
  Bottom 0.25: T31.+ v77.37,47.07
  Bottom 0.5: 79.19,8.73 T7.+ 88.48,8.73 88.51,8.7 89.5,8.7 91.11,10.31 T8.+ 96.37,11.7 100.93,11.7 104.16,14.93 T9.+ 108.87,17.66 111.14,17.66 111.84,18.36 111.84,18.41 T10.+ 119.59,26.16 119.64,26.16 120.34,26.86 120.34,29.13 T11.+ 123.07,33.84 126.3,37.07 126.3,41.63 T12.+ 127.69,46.89 129.3,48.5 129.3,49.49 129.27,49.52 129.27,51.19 | 79.19,8.73 77.52,8.73 77.49,8.7 76.5,8.7 74.89,10.31 T6.+ 69.63,11.7 65.07,11.7 61.84,14.93 T5.+ 57.13,17.66 54.86,17.66 54.16,18.36 54.16,18.41 T4.+ 46.41,26.16 46.36,26.16 45.66,26.86 45.66,29.13 T3.+ 42.93,33.84 39.7,37.07 39.7,41.63 T2.+ 38.31,46.89 36.7,48.5 36.7,49.49 36.73,49.52 T1.+ 36.73,56.91 | 36.73,56.91 36.73,60.48 36.7,60.51 36.7,61.5 38.18,62.99 38.18,66.85 T24.+ 39.7,68.37 39.7,72.93 42.93,76.16 T23.+ 45.66,80.87 45.66,83.14 46.36,83.84 46.41,83.84 T22.+ 54.16,91.59 54.16,91.64 54.86,92.34 57.13,92.34 T21.+ 61.77,95.07 64.99,98.3 69.63,98.3 T20.+ 74.89,99.69 76.5,101.3 77.49,101.3 77.52,101.27 T19.+ 88.48,101.27 88.51,101.3 89.5,101.3 91.11,99.69 T18.+ 96.37,98.3 100.93,98.3 104.16,95.07 T17.+ 108.87,92.34 111.14,92.34 111.84,91.64 111.84,91.59 T16.+ 115.76,87.72 120.34,83.14 120.34,80.87 T15.+ 123.07,76.16 126.3,72.93 126.3,68.37 T14.+ 127.69,63.11 129.3,61.5 129.3,60.51 129.27,60.48 T13.+ 129.27,53.09 | T27.+ 5.64,56.91 16.64,56.91 | 16.64,56.91 27.63,56.91 | 27.63,56.91 36.73,56.91 | 129.27,53.09 129.27,51.19 | T30.+ 160.37,53.09 149.37,53.09 | 149.37,53.09 138.37,53.09 | 138.37,53.09 129.27,53.09 | T29.+ 149.37,53.09 | T28.+ 138.37,53.09 | T26.+ 16.64,56.91 | T25.+ 27.63,56.91
  Bottom 0.5: XH2.P$1 48.05,56.91 36.73,56.91 | U3.VDD 129.27,51.19 | U2.VDD 79.19,8.73 | 81.73,51.83 v77.92,55.63 77.92,60.08 T34.+ 80.64,63.89 v84.27,63.89 84.91,63.89 v86.81,61.98 | 81.73,51.83 v81.73,50.55 78.56,50.55 T31.+ 75.38,51.37 v75.38,53.73 | T32.+ 88.08,49.92 88.08,51.19 | 88.08,51.19 v90.62,53.73 | 88.08,51.19 87.44,51.83 81.73,51.83
GND  (via drill 0.3)
  Top 0.25: C14.2 79.83,46.96 79.83,48.08 79.63,48.28 79.63,49.15 U4.12 | U4.31 89.92,52.67 C1.2 92.31,53.09 v98.24,53.09 | R78.1 76.08,57.33 U4.63 | U4.47 87.03,63.62 C13.2 87.66,64.53 C3.2 | U4.18 86.81,46.59 U2.VSS
  Top 0.5: R28.1 v132.41,55 | R29.1 v143.41,55 | R30.1 v154.42,55 | R27.1 v11.58,55 | R26.1 v22.59,55 | R25.1 v33.59,55 | L32.C 92.12,47.08 R62.1 94.11,45.09 v94.11,43.89 | L31.C 75.08,45.88 R61.1 73.09,43.89 v71.89,43.89 | L34.C 73.88,62.92 R64.1 71.89,64.91 v71.89,66.11 | L33.C 90.92,64.12 R63.1 92.91,66.11 v94.11,66.11 | XH2.P$2 47.76,52.8 C12.2 | C11.2 72.62,51.19 U1.VSS U1.VEE U1.INH | U2.INH U2.VEE U2.VSS
  Bottom 0.5: v132.41,55 132.68,55 L28.C | v143.41,55 143.68,55 L29.C | v154.42,55 154.68,55 L30.C | v11.58,55 11.33,55 L27.C | v22.59,55 21.76,55.83 L26.C | v33.59,55 33.33,55 L25.C
  other vias: 77.92,42.3 76.97,45.16 86.17,46.74 87.44,46.74 93.48,48.33 88.08,34.68 85.54,34.68 88.08,32.14 89.98,60.08 84.27,65.16 77.28,61.98 83,66.75 72.84,61.35 74.75,56.27 64.59,57.22 65.22,60.08 67.76,60.08 62.68,60.08 60.14,60.08 57.6,60.08 55.06,60.08 55.06,65.16 57.6,78.5 48.71,58.17 52.2,50.87 59.5,48.02 45.53,42.62 48.08,37.22 50.62,35.31 54.42,28.96 56.97,26.43 62.68,22.62 65.86,20.08 70.3,18.17 84.27,16.27 89.67,17.22 91.57,17.22 95.38,17.85 88.08,27.06 88.08,29.6 103.95,32.14 93.16,27.06 100.14,20.08 103.32,22.62 109.03,26.43 111.58,28.96 115.38,34.05 117.92,37.22 117.92,38.49 119.83,42.3 117.92,41.03 121.1,55 119.19,56.27 119.19,58.81 124.91,59.45 110.94,60.08 107.13,60.72 103.32,60.08 120.47,63.89 119.83,67.7 117.92,72.14 116.02,75.32 111.58,81.03 109.03,83.58 107.77,84.84 103.32,86.75 100.78,79.13 90.62,92.47 100.14,89.92 67.76,89.29 65.22,89.92 62.68,87.38 56.97,83.58 54.42,81.03 49.98,73.41 48.08,72.14 46.17,63.89 44.27,58.17 45.53,60.72 42.99,61.98 41.73,58.17 37.91,58.17 39.5,65.16 1.4,60.08 3.94,60.08 1.4,49.92 3.94,49.92 164.6,49.92 162.06,49.92 162.06,60.08 164.6,60.08 156.03,58.49 9.97,51.51 29.66,60.08 33.47,63.57 33.47,46.43 29.66,49.92 136.34,49.92 132.53,46.43 132.53,63.57 136.34,60.08 123,61.98 123,63.89 126.5,65.16 123,67.38 121.42,69.29 120.15,72.14 121.73,75.64 116.02,78.5 117.61,76.91 113.16,82.94 114.75,81.35 115.7,86.11 110.94,85.16 109.35,86.75 113.8,88.02 106.81,92.78 106.81,88.66 104.91,89.61 75.38,29.6 64.59,34.68 77.92,34.68 77.92,32.14 77.92,29.6 74.11,42.3 77.92,37.22 100.14,93.1 103,92.15 103.64,94.05 96.02,97.23 98.24,94.69 89.67,94.69 92.21,94.69 93.16,98.5 83.95,100.09 86.81,96.28 81.73,100.09 81.41,95.96 79.19,95.96 73.16,98.5 73.79,95 76.33,95 69.98,97.23 62.36,94.05 63.63,91.83 65.86,93.1 59.5,88.02 61.41,89.61 59.5,93.1 51.89,87.7 55.06,84.84 56.97,86.75 50.3,86.11 53.16,82.94 51.25,81.03 49.98,78.5 48.39,76.91 45.22,78.81 45.85,71.83 43.95,75.64 46.17,74.05 40.77,68.02 43.31,67.38 44.58,69.29 42.99,63.89 44.27,51.51 49.34,51.51 52.52,60.08 44.58,40.71 40.77,41.98 43.31,42.62 45.85,38.17 46.49,35.63 43.95,34.36 49.98,31.5 48.39,33.41 44.9,31.5 51.25,28.96 52.84,27.06 50.3,24.2 52.2,21.98 55.06,24.84 56.65,23.25 59.5,21.98 61.09,20.39 59.19,17.22 66.17,17.85 63.63,18.17 62.36,15.95 68.71,16.9 69.98,12.77 70.62,15.31 78.24,9.91 84.59,14.04 86.81,14.04 84.27,9.91 89.98,14.99 91.89,14.99 92.84,11.5 96.02,13.09 97.29,16.58 95.38,15.31 99.83,17.85 102.37,18.17 103.64,15.95 106.81,17.22 104.59,20.39 106.5,21.98 109.35,23.25 110.94,24.84 114.11,22.3 115.7,23.89 113.16,27.06 114.75,28.65 116.02,31.5 117.61,33.09 121.1,31.5 122.05,34.36 119.83,35.63 120.15,37.86 121.42,40.71 122.69,42.62 125.23,41.98 130.62,51.83 128.09,50.24 37.91,51.19 41.73,51.19 34.1,51.83 35.69,50.24 35.69,53.09 42.04,53.73 51.89,57.54 83,43.25 88.4,25.79 96.65,40.71 127.45,41.35 81.73,105.16 84.27,105.16 81.73,4.84 84.27,4.84 74.43,48.33 62.68,48.02 53.47,44.84 52.2,48.02 45.22,46.74 42.99,46.74 61.41,66.43 70.3,68.65 79.19,64.21 81.41,65.16 109.67,67.7 116.97,61.98 56.65,48.02 87.76,92.47
  pour Top (isolate 0.5, no thermals): -3.36,117.23 171.9,117.23 171.9,-4.69 -3.36,-4.69
  pour Bottom (isolate 0.5, no thermals): -2.09,119.77 169.36,119.77 169.36,-3.42 -2.09,-3.42
LED1
  Top 0.25: U4.51 76.29,65.6 76.29,65.72 71.01,71 61.32,71 R69.2
LED2
  Top 0.25: U4.52 75.89,65.29 75.89,65.55 70.84,70.6 63.46,70.6 R70.2
LED3
  Top 0.25: U4.53 75.49,64.99 75.49,65.39 71.05,69.82 R71.2
LINE_RX_LV  (via drill 0.3)
  Top 0.25: U4.38 88.58,58.81 v91.89,58.81 | v96.97,53.73 113.56,53.73 XH1.1
  Bottom 0.25: v91.89,58.81 v96.97,53.73
LINE_TX_LV  (via drill 0.3)
  Top 0.25: XH1.2 115.98,52.5 114.11,54.37 v95.06,54.37 | v91.25,58.17 91.11,58.32 88.8,58.32 U4.37
  Bottom 0.25: v95.06,54.37 v91.25,58.17
N$1  (via drill 0.3)
  Top 0.25: R31.1 v40.45,49.28
  Bottom 0.25: v40.45,49.28 L1.A
N$2  (via drill 0.3)
  Top 0.25: R32.1 v43.63,38.49
  Bottom 0.25: v43.63,38.49 L2.A
N$3  (via drill 0.3)
  Top 0.25: R33.1 v49.34,28.96
  Bottom 0.25: v49.34,28.96 L3.A
N$4  (via drill 0.3)
  Top 0.25: R34.1 v56.97,21.34
  Bottom 0.25: v56.97,21.34 L4.A
N$5  (via drill 0.3)
  Top 0.25: R35.1 v66.49,15.63
  Bottom 0.25: v66.49,15.63 L5.A
N$6  (via drill 0.3)
  Top 0.25: R36.1 v77.28,12.45
  Bottom 0.25: v77.28,12.45 L6.A
N$7  (via drill 0.3)
  Top 0.25: R37.1 v88.72,12.45
  Bottom 0.25: v88.72,12.45 L7.A
N$8  (via drill 0.3)
  Top 0.25: R38.1 v99.51,15.63
  Bottom 0.25: v99.51,15.63 L8.A
N$9  (via drill 0.3)
  Top 0.25: R39.1 v109.03,21.34
  Bottom 0.25: v109.03,21.34 L9.A
N$10  (via drill 0.3)
  Top 0.25: R40.1 v116.66,28.96
  Bottom 0.25: v116.66,28.96 L10.A
N$11  (via drill 0.3)
  Top 0.25: R41.1 v122.37,38.49
  Bottom 0.25: v122.37,38.49 L11.A
N$12  (via drill 0.3)
  Top 0.25: R42.1 v125.55,49.28
  Bottom 0.25: v125.55,49.28 L12.A
N$13  (via drill 0.3)
  Top 0.25: R43.1 v125.55,60.72
  Bottom 0.25: v125.55,60.72 L13.A
N$14  (via drill 0.3)
  Top 0.25: R44.1 v122.37,71.51
  Bottom 0.25: v122.37,71.51 L14.A
N$15  (via drill 0.3)
  Top 0.25: R45.1 v116.66,81.03
  Bottom 0.25: v116.66,81.03 L15.A
N$16  (via drill 0.3)
  Top 0.25: R46.1 v109.03,88.66
  Bottom 0.25: v109.03,88.66 L16.A
N$17  (via drill 0.3)
  Top 0.25: R47.1 v99.51,94.37
  Bottom 0.25: v99.51,94.37 L17.A
N$18  (via drill 0.3)
  Top 0.25: R48.1 v88.72,97.55
  Bottom 0.25: v88.72,97.55 L18.A
N$19  (via drill 0.3)
  Top 0.25: R49.1 v77.28,97.55
  Bottom 0.25: v77.28,97.55 L19.A
N$20  (via drill 0.3)
  Top 0.25: R50.1 v66.49,94.37
  Bottom 0.25: v66.49,94.37 L20.A
N$21  (via drill 0.3)
  Top 0.25: R51.1 v56.97,88.66
  Bottom 0.25: v56.97,88.66 L21.A
N$22  (via drill 0.3)
  Top 0.25: R52.1 v49.34,81.03
  Bottom 0.25: v49.34,81.03 L22.A
N$23  (via drill 0.3)
  Top 0.25: R53.1 v43.63,71.51
  Bottom 0.25: v43.63,71.51 L23.A
N$24  (via drill 0.3)
  Top 0.25: R54.1 v40.45,60.72
  Bottom 0.25: v40.45,60.72 L24.A
N$25  (via drill 0.3)
  Top 0.25: R55.1 33.5,53.15 v33.5,53
  Bottom 0.25: v33.5,53 32.5,54 L25.A
N$26  (via drill 0.3)
  Top 0.25: R56.1 22.5,53.15 v22.5,53
  Bottom 0.25: v22.5,53 21.5,54 L26.A
N$27  (via drill 0.3)
  Top 0.25: R57.1 11.5,53.15 v11.5,53
  Bottom 0.25: v11.5,53 10.5,54 L27.A
N$28  (via drill 0.3)
  Top 0.25: R58.1 132.5,56.85 v132.5,57
  Bottom 0.25: v132.5,57 133.5,56 L28.A
N$29  (via drill 0.3)
  Top 0.25: R59.1 143.5,56.85 v143.5,57
  Bottom 0.25: v143.5,57 144.5,56 L29.A
N$30  (via drill 0.3)
  Top 0.25: R60.1 154.5,56.85 v154.5,57
  Bottom 0.25: v154.5,57 155.5,56 L30.A
N$31
  Top 0.25: L31.A 73.29,46.46 72.16,46.46 71.22,45.52 71.22,44.42 R65.1
N$32
  Top 0.25: L32.A 91.54,45.29 91.54,44.16 92.48,43.22 93.58,43.22 R66.1
N$33
  Top 0.25: R67.1 94.78,65.58 94.78,64.48 93.22,62.92 L33.A
N$34
  Top 0.25: R68.1 72.42,66.78 73.52,66.78 75.08,65.22 L34.A
N$35
  Top 0.25: L35.A R69.1
N$36
  Top 0.25: R70.1 L36.A
N$37
  Top 0.25: L37.A R71.1
N$42
  Top 0.25: U4.30 90.91,50.98 C1.1
N$43
  Top 0.25: R78.2 76.5,59.02 U4.60
N$44
  Top 0.25: U4.5 82.68,57.16 82.68,65.62 X2.P$2 80.6,70.95 C2.1
N$45
  Top 0.25: U4.6 83.32,57.09 83.32,65.62 X2.P$1 85.4,70.95 C3.1
PA_13  (via drill 0.3)
  Top 0.25: XH1.3 116.02,56.27 98.24,56.27 v91.89,56.27 | U4.46 84.27,60.16 84.27,57.54 v85.54,56.27
  Bottom 0.25: v91.89,56.27 v85.54,56.27
PA_14  (via drill 0.3)
  Top 0.25: XH1.4 116.69,56.91 v91.25,56.91 | U4.49 82.18,61.12 82.18,59.9 v81.73,59.45
  Bottom 0.25: v91.25,56.91 85.86,56.91 83.32,59.45 v81.73,59.45
RST  (via drill 0.3)
  Top 0.25: C11.1 74.13,50.96 77.9,50.96 U4.7 82.57,55.63 v84.91,55.63 | v90.62,55.63 v112.84,55.63
  Bottom 0.25: v84.91,55.63 v90.62,55.63 | v112.84,55.63 112.92,55.63 XH1.5
S1
  Top 0.25: T1.- R1.2
  Bottom 0.25: T1.- 44.35,49.92 55.06,49.92 U1.2Y
S2
  Top 0.25: T2.- R2.2
  Bottom 0.25: U1.3Y 53.9,43.68 T2.-
S3
  Top 0.25: T3.- R3.2
  Bottom 0.25: T3.- 45.9,33.14 U1.1Y
S4
  Top 0.25: T4.- R4.2
  Bottom 0.25: T4.- 63.95,35.95 U2.0X
S5
  Top 0.25: R5.2 T5.-
  Bottom 0.25: T5.- 74.88,30.87 U2.1X
S6
  Top 0.25: T6.- R6.2
  Bottom 0.25: U2.2X 71.68,20.82 T6.-
S7
  Top 0.25: R7.2 T7.-
  Bottom 0.25: T7.- 83,34.68 U2.3X
S8
  Top 0.25: R8.2 T8.-
  Bottom 0.25: U2.0Y 94.32,18.28 T8.-
S9
  Top 0.25: R9.2 T9.-
  Bottom 0.25: U2.2Y 93.16,28.33 93.66,28.33 T9.-
S10
  Top 0.25: R10.2 T10.-
  Bottom 0.25: U2.3Y 104.59,33.41 T10.-
S11
  Top 0.25: R11.2 T11.-
  Bottom 0.25: U2.1Y 118.06,35.95 T11.-
S12
  Top 0.25: R12.2 T12.-
  Bottom 0.25: T12.- 107.02,43.68 U3.3X
S13
  Top 0.25: R13.2 T13.-
  Bottom 0.25: T13.- 125.46,53.73 112.21,53.73 U3.2X
S14
  Top 0.25: R14.2 T14.-
  Bottom 0.25: U3.0Y 119.72,66.32 T14.-
S15
  Top 0.25: R15.2 T15.-
  Bottom 0.25: U3.2Y 109.67,65.66 T15.-
S16
  Top 0.25: R16.2 T16.-
  Bottom 0.25: U3.1X 108.4,52.46 108.4,80.4 T16.-
S17
  Top 0.25: R17.2 T17.-
  Bottom 0.25: U3.0X 105.86,55 105.86,91.88 T17.-
S18
  Top 0.25: R18.2 T18.-
  Bottom 0.25: U3.3Y 104.59,86.97 T18.-
S19
  Top 0.25: T19.- R19.2
  Bottom 0.25: U3.1Y 102.05,79.68 T19.-
S20
  Top 0.25: T20.- R20.2
  Bottom 0.25: U1.3X 66.49,92.05 T20.-
S21
  Top 0.25: T21.- R21.2
  Bottom 0.25: U1.0X 63.95,90.06 T21.-
S22
  Top 0.25: T22.- R22.2
  Bottom 0.25: T22.- | U1.1X 58.87,79.13 T22.-
S23
  Top 0.25: T23.- R23.2
  Bottom 0.25: T23.- 45.13,76.59 56.33,65.39 U1.2X
S24
  Top 0.25: T24.- R24.2
  Bottom 0.25: U1.0Y 51.25,53.73 51.25,56.91 41.84,66.32 T24.-
S25  (via drill 0.3)
  Top 0.25: T27.- R27.2 11.33,51.83 22.33,51.83 | T26.- R26.2 22.33,51.83 | T25.- R25.2 30.15,54.51 32.84,51.83 | 32.84,51.83 36.65,48.02 v42.99,48.02 | v45.53,48.02 50.62,48.02 51.89,49.28 75.81,49.28 77.08,48.02 77.92,48.02 78.56,48.65 78.56,49.49 U4.10 | 32.84,51.83 23.31,51.83 22.33,51.83
  Bottom 0.25: v45.53,48.02 v42.99,48.02
S26  (via drill 0.3)
  Top 0.25: T28.- R28.2 132.68,58.17 | T29.- R29.2 143.68,58.17 | R30.2 157.93,55 | 157.93,55 T30.- | v121.73,58.17 121.73,56.91 118.56,53.73 116.02,53.73 114.75,55 89.54,55 87.36,52.82 87.36,52.41 U4.27 | 157.93,55 154.75,58.17 143.68,58.17 | v124.28,58.17 132.68,58.17 | 132.68,58.17 143.68,58.17
  Bottom 0.25: v124.28,58.17 v121.73,58.17
S27  (via drill 0.3)
  Top 0.25: T31.- 73.44,45.44 R61.2 | U4.11 79.19,49.42 v79.19,47.38
  Bottom 0.25: T31.- 77.04,46.11 77.92,46.11 v79.19,47.38
S28
  Top 0.25: R62.2 92.56,45.44 T32.- 89.11,47.58 87.7,48.99 87.7,49.24 U4.23
S29  (via drill 0.3)
  Top 0.25: T33.- 92.56,64.56 R63.2 | U4.24 86.17,51.47 v86.17,57.54
  Bottom 0.25: T33.- 88.52,62.42 86.17,60.08 v86.17,57.54
S30
  Top 0.25: R64.2 73.44,64.56 T34.-
U1A
  Top 0.25: U1.A 70.3,60.08 76.15,60.08 U4.59
U1B
  Top 0.25: U1.B 72.2,58.17 75.94,58.17 U4.62
U1X  (via drill 0.3)
  Top 0.25: U4.8 79.47,51.83 v80.46,51.83 | U1.X-COM 65.22,55 v77.28,55
  Bottom 0.25: v80.46,51.83 v77.28,55
U1Y
  Top 0.25: U1.Y-COM 60.14,49.92 76.02,49.92 76.65,50.55 77.92,50.55 78.21,50.26 78.61,50.26 U4.9
U2A  (via drill 0.3)
  Top 0.25: v86.81,48.02 U4.20
  Bottom 0.25: U2.A 86.17,48.02 v86.81,48.02
U2B  (via drill 0.3)
  Top 0.25: v84.27,50.55 84.97,50.55 U4.21
  Bottom 0.25: U2.B 84.27,48.65 v84.27,50.55
U2X
  Top 0.25: U2.X-COM 81.64,35.86 U4.16
U2Y
  Top 0.25: U4.17 84.36,33.31 U2.Y-COM
U3A  (via drill 0.3)
  Top 0.25: v88.08,55 88.3,55 U4.33
  Bottom 0.25: U3.A 93.16,55 v88.08,55
U3B  (via drill 0.3)
  Top 0.25: v86.81,55 87.98,56.17 88.77,56.17 U4.34
  Bottom 0.25: U3.B 94.43,52.46 92.53,54.37 87.44,54.37 v86.81,55
U3X
  Top 0.25: U4.25 87.79,50.57 89.02,50.57 89.67,49.92 103.32,49.92 U3.X-COM
U3Y  (via drill 0.3)
  Top 0.25: U4.26 88.09,50.97 89.13,50.97 v89.35,51.19 | v105.22,53.07 104.61,52.46 v93.16,52.46
  Bottom 0.25: U3.Y-COM 107.13,54.98 v105.22,53.07 | v89.35,51.19 91.89,51.19 v93.16,52.46